# Altium schematic sheet var_05_scheme.SchDoc
size A4; SheetNumber: 5; SheetTotal: 10
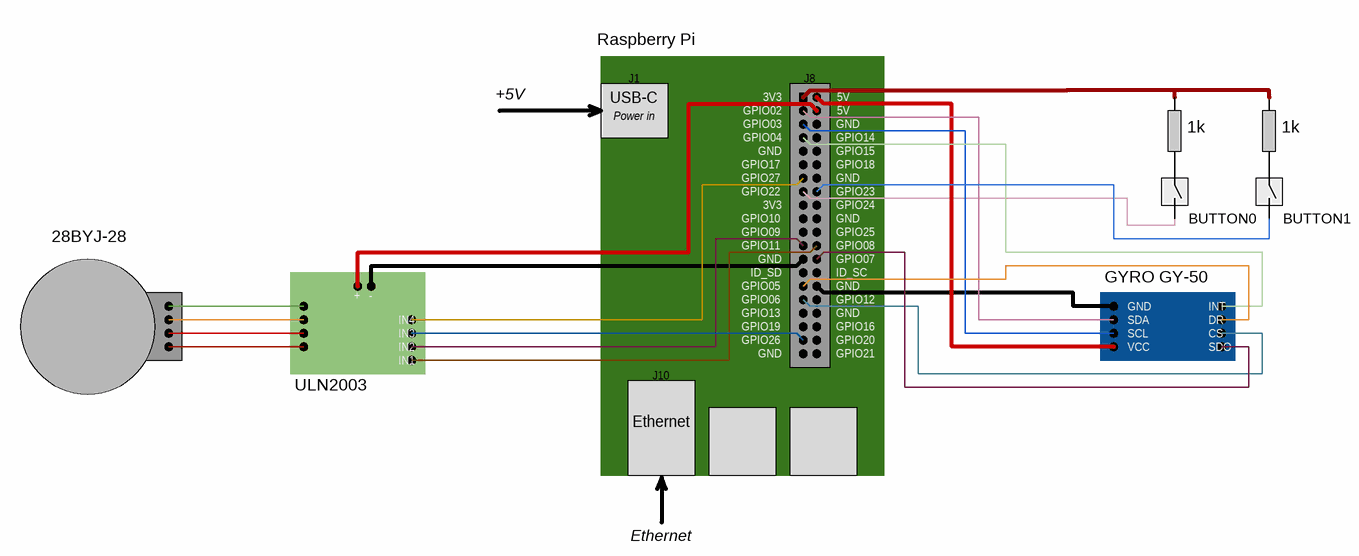
[diagram p0: var_05_scheme.SchDoc]

## Notes on the sheet
- Raspberry Pi
- +5V
- USB-C
- Power in
- J1
- 3V3
- GPIO02
- GPIO03
- J8
- GND
- 5V
- 1k
- GPIO17
- GPIO27
- GPIO22
- GPIO04
- GPIO14
- GPIO15
- GPIO18
- GPIO23
- 28BYJ-28
- GPIO09
- GPIO10
- GPIO11
- GPIO24
- GPIO25
- GPIO08
- GPIO07
- BUTTON0
- BUTTON1
- +
- -
- IN4
- GPIO05
- GPIO06
- GPIO13
- GPIO19
- ID_SD
- ID_SC
- GPIO12
- GPIO16
- GYRO GY-50
- SDA
- INT
- DR
- ULN2003
- IN3
- IN2
- IN1
- J10
- GPIO26
- GPIO20
- GPIO21
- SCL
- VCC
- CS
- SDO
- Ethernet